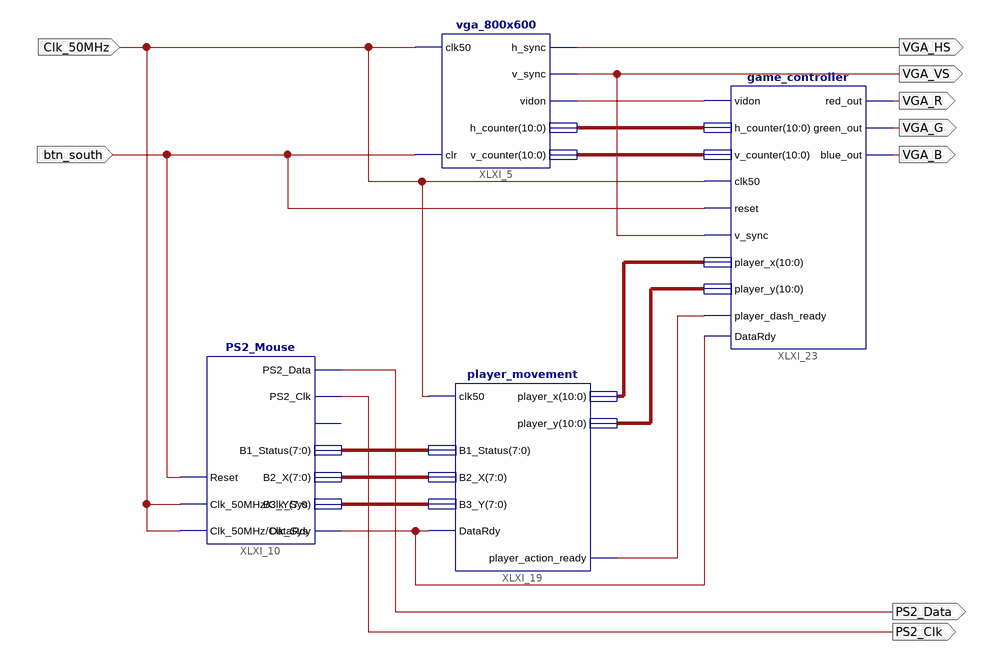
[diagram p0: schematic sheet 1]
// Xilinx ISE schematic SCHEME.sch (spartan3e) as structural Verilog: 4 symbols, 9 ports
module SCHEME (
  input  Clk_50MHz,
  input  btn_south,
  output VGA_HS,
  output VGA_VS,
  output VGA_R,
  output VGA_G,
  output VGA_B,
  output PS2_Data,
  output PS2_Clk
);

  wire XLXN_51, XLXN_59, XLXN_79;
  wire [7:0] XLXN_15, XLXN_16, XLXN_17;
  wire [10:0] XLXN_3, XLXN_4, XLXN_7, XLXN_8;

  vga_800x600 XLXI_5 (
    .clk50(Clk_50MHz), .clr(btn_south), .h_sync(VGA_HS), .v_sync(VGA_VS), .vidon(XLXN_59),
    .h_counter(XLXN_3), .v_counter(XLXN_4));
  PS2_Mouse XLXI_10 (
    .PS2_Data(PS2_Data), .PS2_Clk(PS2_Clk), .DataRdy(XLXN_51), .B1_Status(XLXN_15), .B2_X(XLXN_16),
    .B3_Y(XLXN_17), .Clk_50MHz(Clk_50MHz), .Reset(btn_south), .Clk_Sys(Clk_50MHz));  // open: InitOK
  player_movement XLXI_19 (
    .clk50(Clk_50MHz), .B1_Status(XLXN_15), .B2_X(XLXN_16), .B3_Y(XLXN_17), .DataRdy(XLXN_51),
    .player_x(XLXN_7), .player_y(XLXN_8), .player_action_ready(XLXN_79));
  game_controller XLXI_23 (
    .vidon(XLXN_59), .red_out(VGA_R), .green_out(VGA_G), .blue_out(VGA_B), .h_counter(XLXN_3),
    .v_counter(XLXN_4), .clk50(Clk_50MHz), .reset(btn_south), .DataRdy(XLXN_51), .v_sync(VGA_VS),
    .player_x(XLXN_7), .player_y(XLXN_8), .player_dash_ready(XLXN_79));
endmodule
